# Altium project COAD_Project1.PrjPcb
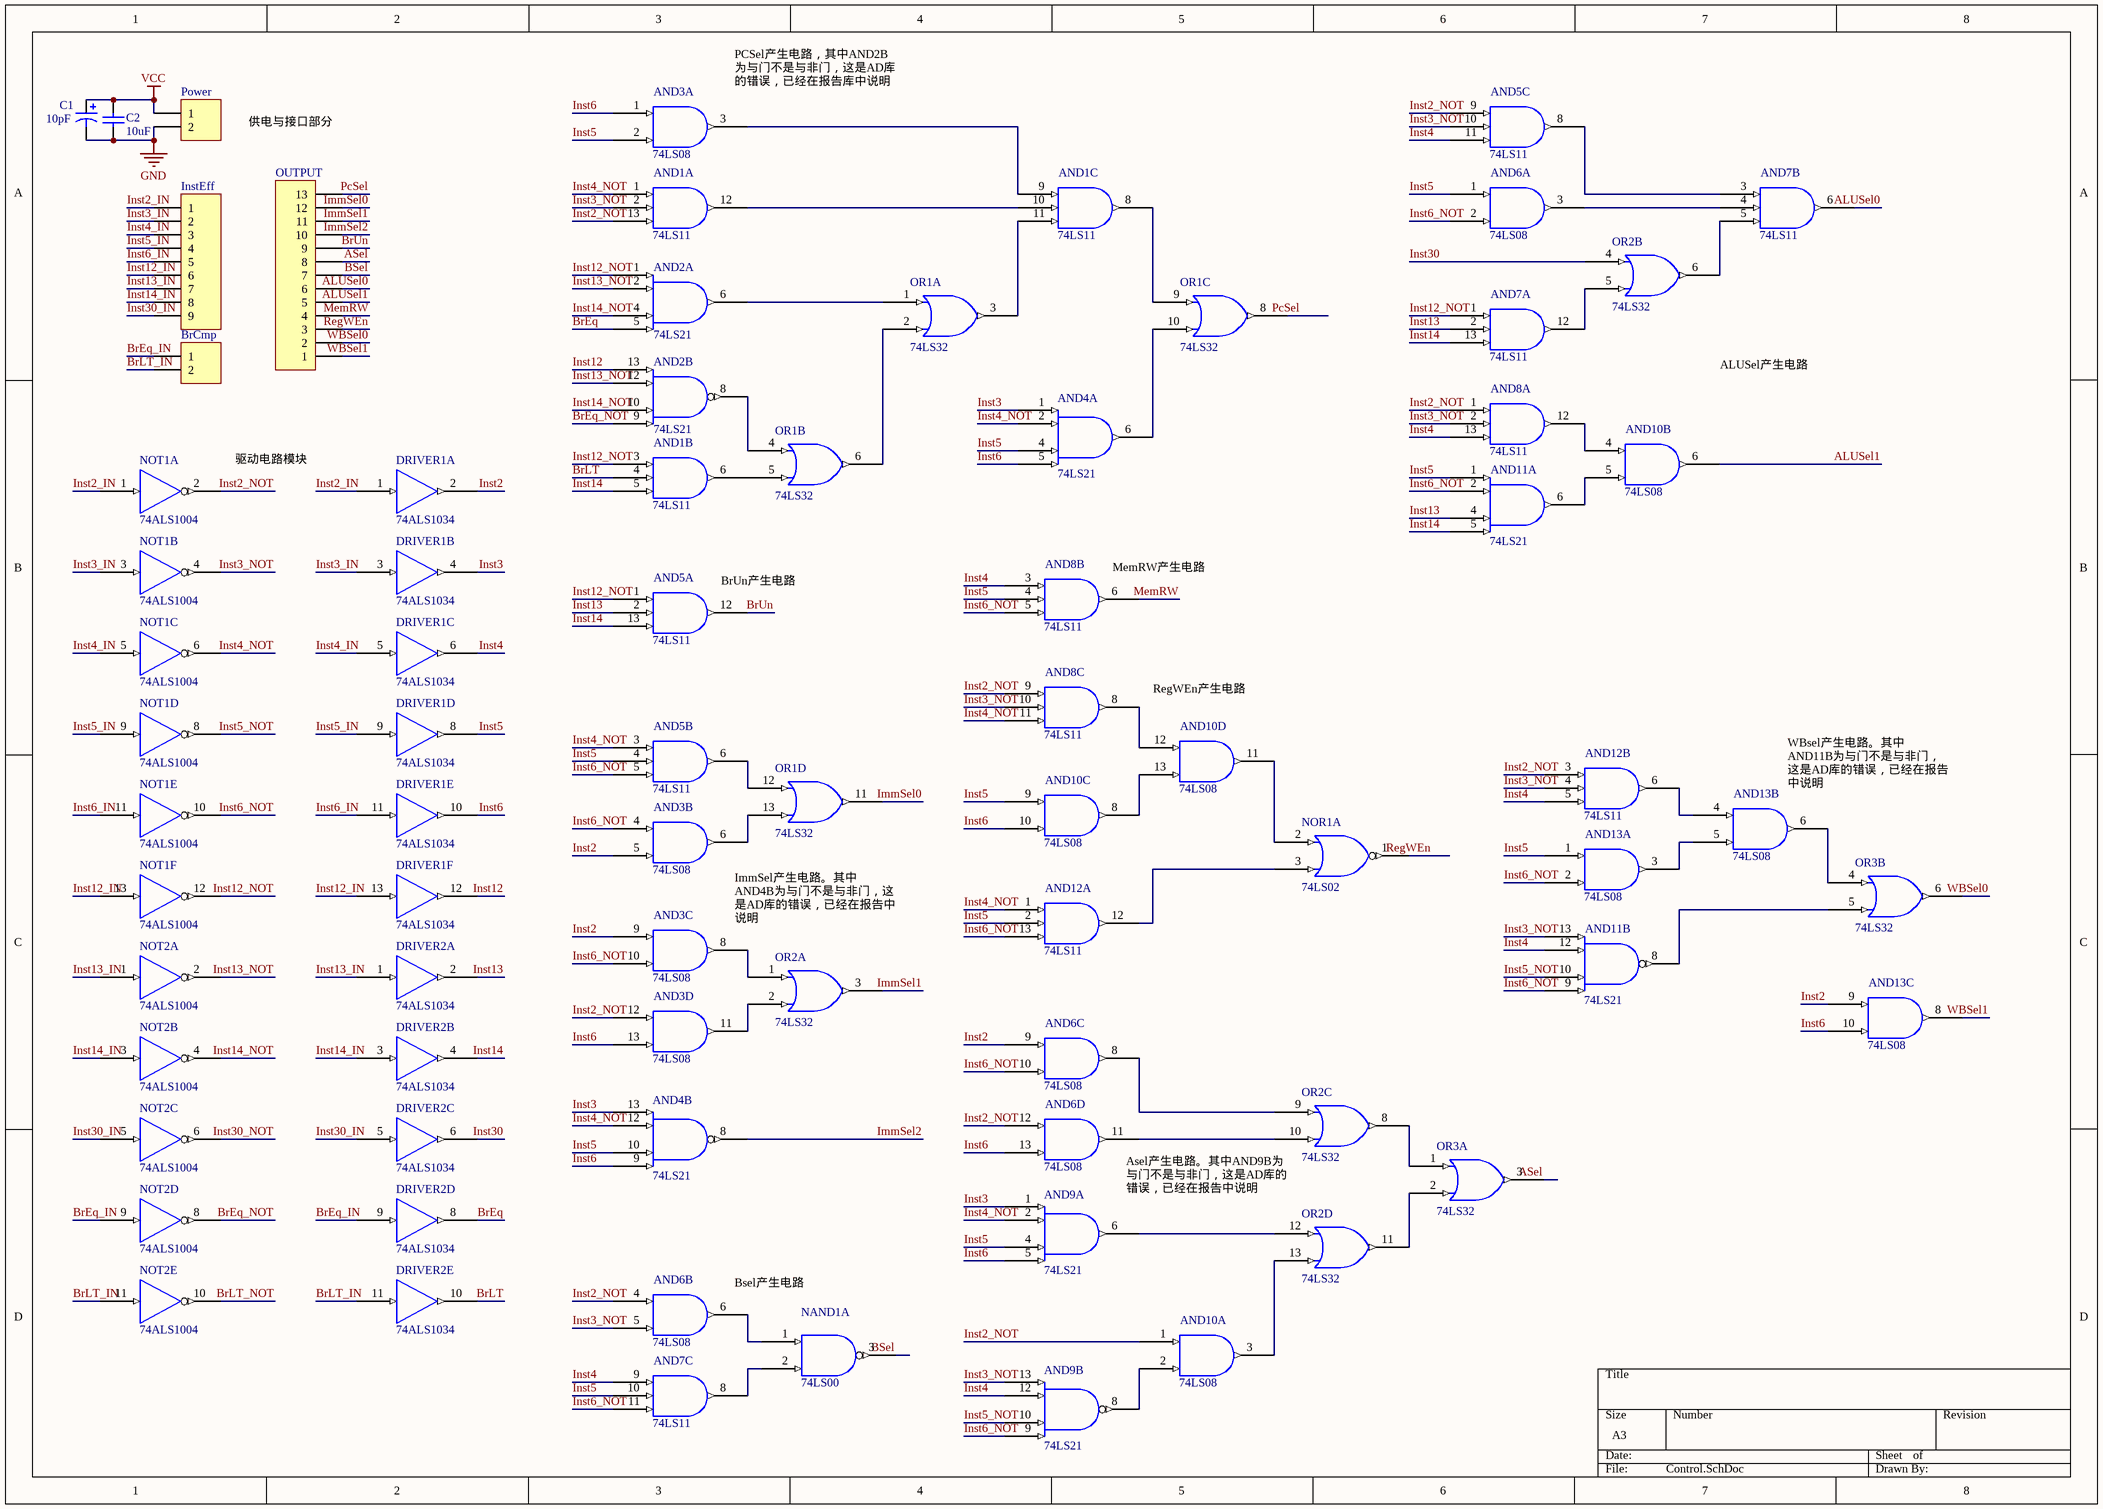
[diagram p0: Control.SchDoc]
1 sheet, 28 parts. Net scope: global (net labels, ports and power ports of the same name join across sheets).

## Sheet Control.SchDoc
size A3

### Parts
AND1  74LS11  [DIP-14]  (parts A,B,C of 3)
AND2  74LS21  [DIP-14]  (parts A,B of 2)
AND3  74LS08  [DIP-14]  (parts A,B,C,D of 4)
AND4  74LS21  [DIP-14]  (parts A,B of 2)
AND5  74LS11  [DIP-14]  (parts A,B,C of 3)
AND6  74LS08  [DIP-14]  (parts A,B,C,D of 4)
AND7  74LS11  [DIP-14]  (parts A,B,C of 3)
AND8  74LS11  [DIP-14]  (parts A,B,C of 3)
AND9  74LS21  [DIP-14]  (parts A,B of 2)
AND10  74LS08  [DIP-14]  (parts A,B,C,D of 4)
AND11  74LS21  [DIP-14]  (parts A,B of 2)
AND12  74LS11  [DIP-14]  (parts A,B of 3)
AND13  74LS08  [DIP-14]  (parts A,B,C of 4)
BrCmp  Header 2  [HDR1X2]  (value not drawn)
C1  value 10pF  [RB7.6-15]  (hidden comment: Cap Pol1)
C2  value 10uF  [RAD-0.3]  (hidden comment: Cap)
DRIVER1  74ALS1034  [DIP-14]  (parts A,B,C,D,E,F of 6)
DRIVER2  74ALS1034  [DIP-14]  (parts A,B,C,D,E of 6)
InstEff  Header 9  [HDR1X9]  (value not drawn)
NAND1  74LS00  [DIP-14]  (part A of 4)
NOR1  74LS02  [DIP-14]  (part A of 4)
NOT1  74ALS1004  [DIP-14]  (parts A,B,C,D,E,F of 6)
NOT2  74ALS1004  [DIP-14]  (parts A,B,C,D,E of 6)
OR1  74LS32  [DIP-14]  (parts A,B,C,D of 4)
OR2  74LS32  [DIP-14]  (parts A,B,C,D of 4)
OR3  74LS32  [DIP-14]  (parts A,B of 4)
OUTPUT  Header 13  [HDR1X13]  (value not drawn)
Power  Header 2  [HDR1X2]  (value not drawn)

### Nets
GND: AND1.7(GND) AND2.7(GND) AND3.7(GND) AND4.7(GND) AND5.7(GND) AND6.7(GND) AND7.7(GND) AND8.7(GND) AND9.7(GND) AND10.7(GND) AND11.7(GND) AND12.7(GND) AND13.7(GND) C1.2 C2.1 DRIVER1.7(GND) DRIVER2.7(GND) NAND1.7(GND) NOR1.7(GND) NOT1.7(GND) NOT2.7(GND) OR1.7(GND) OR2.7(GND) OR3.7(GND) Power.2
VCC: AND1.14(VCC) AND2.14(VCC) AND3.14(VCC) AND4.14(VCC) AND5.14(VCC) AND6.14(VCC) AND7.14(VCC) AND8.14(VCC) AND9.14(VCC) AND10.14(VCC) AND11.14(VCC) AND12.14(VCC) AND13.14(VCC) C1.1 C2.2 DRIVER1.14(VCC) DRIVER2.14(VCC) NAND1.14(VCC) NOR1.14(VCC) NOT1.14(VCC) NOT2.14(VCC) OR1.14(VCC) OR2.14(VCC) OR3.14(VCC) Power.1
ALUSel0: AND7.6 OUTPUT.6
ALUSel1: AND10.6 OUTPUT.5
ASel: OR3.3 OUTPUT.8
BrEq: AND2.5 DRIVER2.8
BrEq_IN: BrCmp.1 DRIVER2.9 NOT2.9
BrEq_NOT: AND2.9 NOT2.8
BrLT: AND1.4 DRIVER2.10
BrLT_IN: BrCmp.2 DRIVER2.11 NOT2.11
BrLT_NOT: NOT2.10
BrUn: AND5.12 OUTPUT.9
BSel: NAND1.3 OUTPUT.7
ImmSel0: OR1.11 OUTPUT.12
ImmSel1: OR2.3 OUTPUT.11
ImmSel2: AND4.8 OUTPUT.10
Inst2: AND3.5 AND3.9 AND6.9 AND13.9 DRIVER1.2
Inst2_IN: DRIVER1.1 InstEff.1 NOT1.1
Inst2_NOT: AND1.13 AND3.12 AND5.9 AND6.4 AND6.12 AND8.1 AND8.9 AND10.1 AND12.3 NOT1.2
Inst3: AND4.1 AND4.13 AND9.1 DRIVER1.4
Inst3_IN: DRIVER1.3 InstEff.2 NOT1.3
Inst3_NOT: AND1.2 AND5.10 AND6.5 AND8.2 AND8.10 AND9.13 AND11.13 AND12.4 NOT1.4
Inst4: AND5.11 AND7.9 AND8.3 AND8.13 AND9.12 AND11.12 AND12.5 DRIVER1.6
Inst4_IN: DRIVER1.5 InstEff.3 NOT1.5
Inst4_NOT: AND1.1 AND4.2 AND4.12 AND5.3 AND8.11 AND9.2 AND12.1 NOT1.6
Inst5: AND3.2 AND4.4 AND4.10 AND5.4 AND6.1 AND7.10 AND8.4 AND9.4 AND10.9 AND11.1 AND12.2 AND13.1 DRIVER1.8
Inst5_IN: DRIVER1.9 InstEff.4 NOT1.9
Inst5_NOT: AND9.10 AND11.10 NOT1.8
Inst6: AND3.1 AND3.13 AND4.5 AND4.9 AND6.13 AND9.5 AND10.10 AND13.10 DRIVER1.10
Inst6_IN: DRIVER1.11 InstEff.5 NOT1.11
Inst6_NOT: AND3.4 AND3.10 AND5.5 AND6.2 AND6.10 AND7.11 AND8.5 AND9.9 AND11.2 AND11.9 AND12.13 AND13.2 NOT1.10
Inst12: AND2.13 DRIVER1.12
Inst12_IN: DRIVER1.13 InstEff.6 NOT1.13
Inst12_NOT: AND1.3 AND2.1 AND5.1 AND7.1 NOT1.12
Inst13: AND5.2 AND7.2 AND11.4 DRIVER2.2
Inst13_IN: DRIVER2.1 InstEff.7 NOT2.1
Inst13_NOT: AND2.2 AND2.12 NOT2.2
Inst14: AND1.5 AND5.13 AND7.13 AND11.5 DRIVER2.4
Inst14_IN: DRIVER2.3 InstEff.8 NOT2.3
Inst14_NOT: AND2.4 AND2.10 NOT2.4
Inst30: DRIVER2.6 OR2.4
Inst30_IN: DRIVER2.5 InstEff.9 NOT2.5
Inst30_NOT: NOT2.6
MemRW: AND8.6 OUTPUT.4
PcSel: OR1.8 OUTPUT.13
RegWEn: NOR1.1 OUTPUT.3
WBSel0: OR3.6 OUTPUT.2
WBSel1: AND13.8 OUTPUT.1
NetAND1_6: AND1.6 OR1.5
NetAND1_8: AND1.8 OR1.9
NetAND1_9: AND1.9 AND3.3
NetAND1_10: AND1.10 AND1.12
NetAND1_11: AND1.11 OR1.3
NetAND2_6: AND2.6 OR1.1
NetAND2_8: AND2.8 OR1.4
NetAND3_6: AND3.6 OR1.13
NetAND3_8: AND3.8 OR2.1
NetAND3_11: AND3.11 OR2.2
NetAND4_6: AND4.6 OR1.10
NetAND5_6: AND5.6 OR1.12
NetAND5_8: AND5.8 AND7.3
NetAND6_3: AND6.3 AND7.4
NetAND6_6: AND6.6 NAND1.1
NetAND6_8: AND6.8 OR2.9
NetAND6_11: AND6.11 OR2.10
NetAND7_5: AND7.5 OR2.6
NetAND7_8: AND7.8 NAND1.2
NetAND7_12: AND7.12 OR2.5
NetAND8_8: AND8.8 AND10.12
NetAND8_12: AND8.12 AND10.4
NetAND9_6: AND9.6 OR2.12
NetAND9_8: AND9.8 AND10.2
NetAND10_3: AND10.3 OR2.13
NetAND10_5: AND10.5 AND11.6
NetAND10_8: AND10.8 AND10.13
NetAND10_11: AND10.11 NOR1.2
NetAND11_8: AND11.8 OR3.5
NetAND12_6: AND12.6 AND13.4
NetAND12_12: AND12.12 NOR1.3
NetAND13_3: AND13.3 AND13.5
NetAND13_6: AND13.6 OR3.4
NetOR1_2: OR1.2 OR1.6
NetOR2_8: OR2.8 OR3.1
NetOR2_11: OR2.11 OR3.2

### Notes on the sheet
- (near AND3) PCSel产生电路，其中AND2B为与门不是与非门，这是AD库的错误，已经在报告库中说明
- 供电与接口部分
- ALUSel产生电路
- (near DRIVER1) 驱动电路模块
- (near AND8) MemRW产生电路
- (near AND5) BrUn产生电路
- RegWEn产生电路
- (near AND13) WBsel产生电路。其中AND11B为与门不是与非门，这是AD库的错误，已经在报告中说明
- (near AND3) ImmSel产生电路。其中AND4B为与门不是与非门，这是AD库的错误，已经在报告中说明
- Asel产生电路。其中AND9B为与门不是与非门，这是AD库的错误，已经在报告中说明
- Bsel产生电路

### Library data of the parts
BrCmp Power = Header 2: Header, 2-Pin; LatestRevisionDate: 17-Jul-2002; LatestRevisionNote: Re-released for DXP Platform.; Publisher: Altium Limited
C1 = Cap Pol1: Polarized Capacitor (Radial); Published: 8-Jun-2000; LatestRevisionDate: 17-Jul-2002; LatestRevisionNote: Re-released for DXP Platform.; PackageReference: RB7.6-15; Publisher: Altium Limited; PackageDescription: Polarized Capacitor (Radial); 2 Leads
C2 = Cap: Capacitor; Published: 8-Jun-2000; LatestRevisionDate: 17-Jul-2002; LatestRevisionNote: Re-released for DXP Platform.; PackageReference: RAD-0.3; Publisher: Altium Limited; PackageDescription: Radial Cap, Thru-Hole; 2 Leads; 0.3 in Pin Spacing
DRIVER1 DRIVER2 = 74ALS34
InstEff = Header 9: Header, 9-Pin; LatestRevisionDate: 17-Jul-2002; LatestRevisionNote: Re-released for DXP Platform.; Publisher: Altium Limited
NOT1 NOT2 = 74LS04
OUTPUT = Header 13: Header, 13-Pin; LatestRevisionDate: 17-Jul-2002; LatestRevisionNote: Re-released for DXP Platform.; Publisher: Altium Limited